# EAGLE design ATMega328Programmer (EAGLE 6.1)
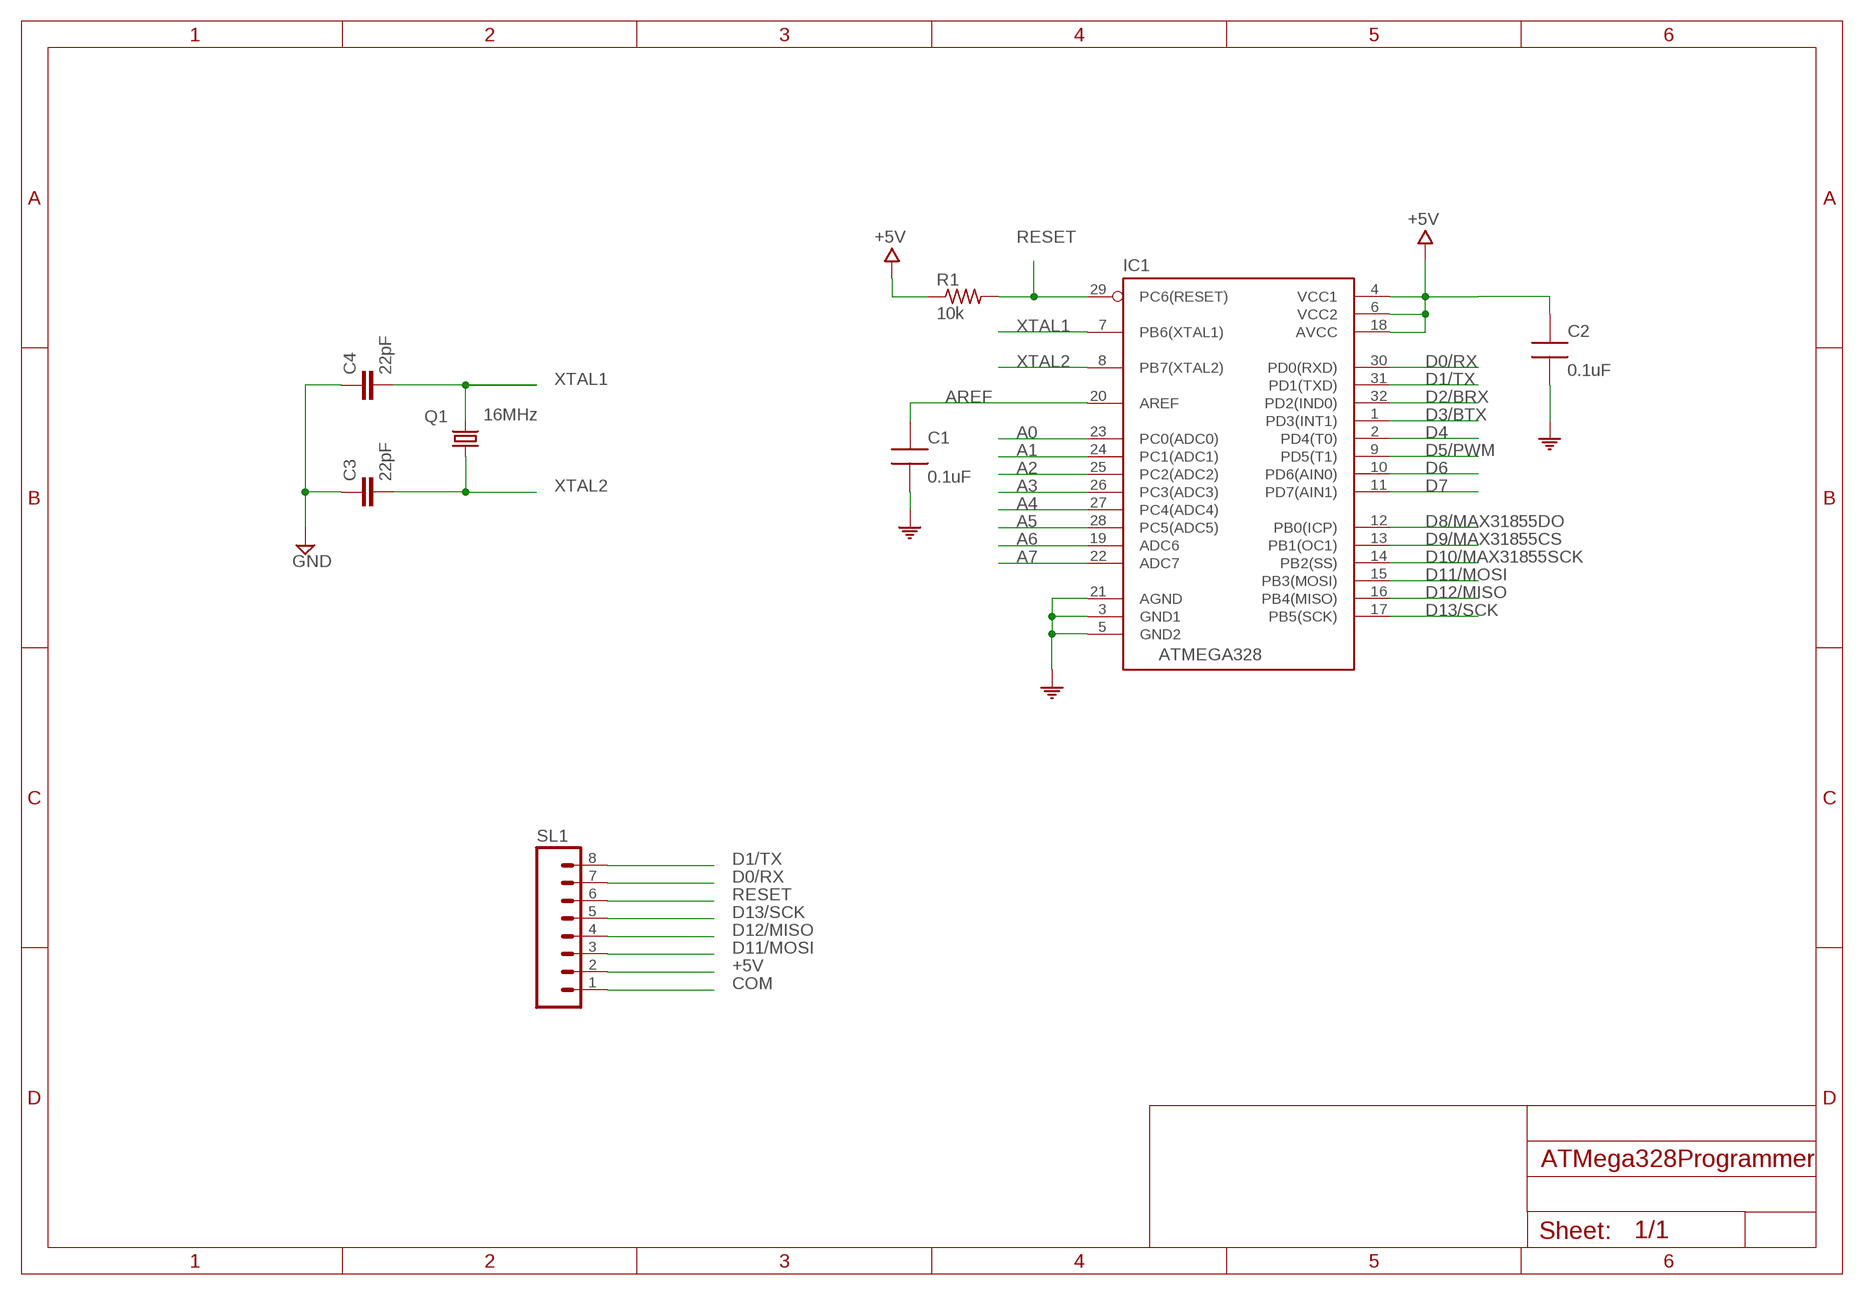
[diagram p0: schematic, sheet 1]

## Parts
C1  0.1uF  CAP0805-NP  [CAP0805-NP]
C2  0.1uF  CAP0805-NP  [CAP0805-NP]
C3  22pF  C-EUC0805  [C0805]
C4  22pF  C-EUC0805  [C0805]
IC1  ATMEGA328  ATMEGA168-20AU  [QFP032]
Q1  16MHz  CRYSTALHC49S  [HC49/S]
R1  10k  R-US_M0805  [M0805]
SL1  M08  [08P]

## Nets
+5V: C2.1 IC1.4(VCC1) IC1.6(VCC2) IC1.18(AVCC) R1.1 SL1.2
A0: IC1.23(PC0(ADC0))
A1: IC1.24(PC1(ADC1))
A2: IC1.25(PC2(ADC2))
A3: IC1.26(PC3(ADC3))
A4: IC1.27(PC4(ADC4))
A5: IC1.28(PC5(ADC5))
A6: IC1.19(ADC6)
A7: IC1.22(ADC7)
AREF: C1.1 IC1.20(AREF)
COM: C1.2 C2.2 C3.1 C4.1 IC1.3(GND1) IC1.5(GND2) IC1.21(AGND) SL1.1 ; supply symbol labelled GND
D0/RX: IC1.30(PD0(RXD)) SL1.7
D1/TX: IC1.31(PD1(TXD)) SL1.8
D2/BRX: IC1.32(PD2(IND0))
D3/BTX: IC1.1(PD3(INT1))
D4: IC1.2(PD4(T0))
D5/PWM: IC1.9(PD5(T1))
D6: IC1.10(PD6(AIN0))
D7: IC1.11(PD7(AIN1))
D8/MAX31855DO: IC1.12(PB0(ICP))
D9/MAX31855CS: IC1.13(PB1(OC1))
D10/MAX31855SCK: IC1.14(PB2(SS))
D11/MOSI: IC1.15(PB3(MOSI)) SL1.3
D12/MISO: IC1.16(PB4(MISO)) SL1.4
D13/SCK: IC1.17(PB5(SCK)) SL1.5
RESET: IC1.29(PC6(RESET)) R1.2 SL1.6
XTAL1: C4.2 IC1.7(PB6(XTAL1)) Q1.2
XTAL2: C3.2 IC1.8(PB7(XTAL2)) Q1.1

## Notes on the sheet
- RESET
- XTAL1
- XTAL2
- XTAL1
- XTAL2
- D1/TX
- D0/RX
- RESET
- D13/SCK
- D12/MISO
- D11/MOSI
- +5V
- COM

## Library data of the parts
C1 C2 = MySMD:CAP0805-NP
C3 C4 = rcl:C-EU: CAPACITOR, European symbol
IC1 = MySMD:ATMEGA168-20AU
Q1 = crystal:CRYSTAL: CRYSTAL
R1 = rcl:R-US_: RESISTOR, American symbol
SL1 = con-amp-quick:M08: AMP QUICK CONNECTOR; OC_FARNELL: unknown; OC_NEWARK: unknown

## Net classes
1 Power: width 1.016 mm, drill 0.61 mm, clearance 0.61 mm

## Board
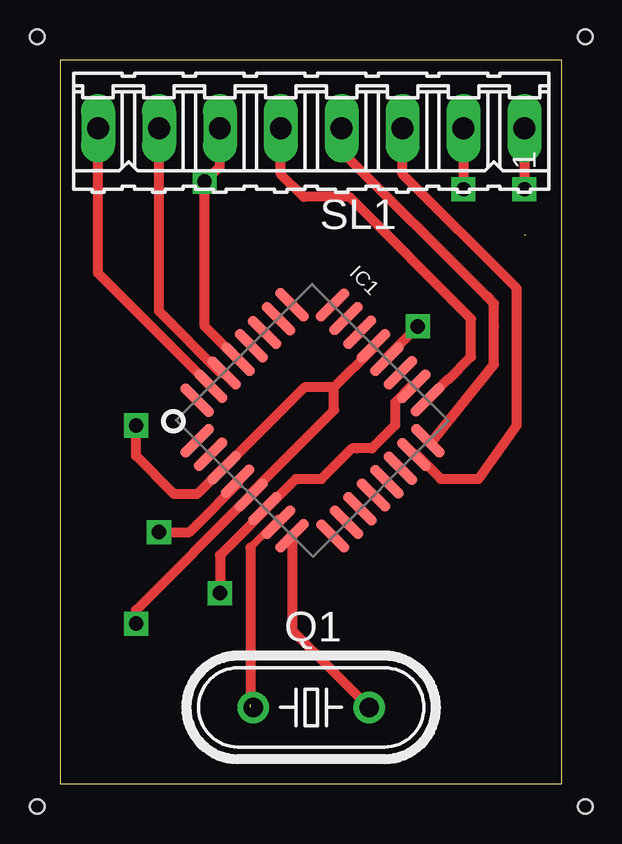
[diagram p1: board, top side]
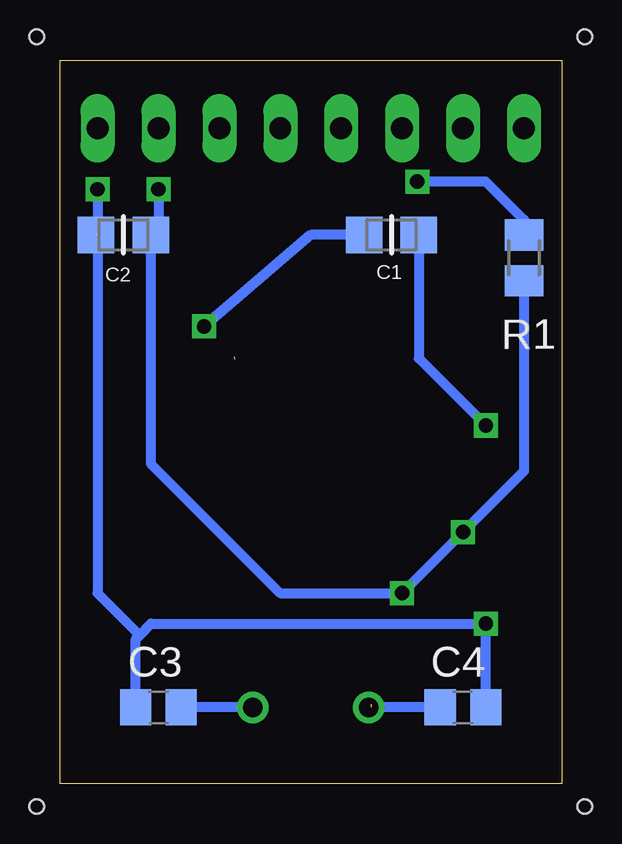
[diagram p2: board, bottom side, seen from below]

Size 20.93 x 30.15 mm. Coordinates in mm from the lower left corner, seen from the top.
Outline: 0,0 20.93,0 20.93,30.15 0,30.15 0,0
Copper layers (1*16): Top 0.035mm / dielectric 1.5mm / Bottom 0.035mm
Design rules: minimum track width 10mil, minimum drill 24mil, track to track 8mil, track to pad 8mil, pad to pad 8mil, via to via 8mil, smd to smd 8mil, copper to edge 40mil, drill to drill 8mil, minimum pad ring 10mil, minimum via ring 8mil, stop-mask expansion 4mil, vias tented up to drill 0mil, thermal gap 10mil
Holes 0.6 mm at -0.95,-0.95 21.91,-0.95 21.91,31.11 -0.95,31.11

### Footprints (pad centres in the part's own frame; a part is rotated, then mirrored left to right if it is on the bottom)
CAP0805-NP = smd 1.524 x 1.524: 1 0,0; 2 2.286,0
C0805 = smd 1.3 x 1.5: 1 -0.95,0; 2 0.95,0
QFP032 = smd 0.432 x 1.778: 1 0,0; 2 0.8,0; 3 1.599,0; 4 2.399,0; 5 3.199,0; 6 3.998,0; 7 4.798,0; 8 5.598,0; 17 5.588,8.001; 18 4.798,7.997; 19 3.998,7.997; 20 3.199,7.997; 21 2.399,7.997; 22 1.599,7.997; 23 0.799,7.997; 24 0,7.997 | smd 1.778 x 0.432: 9 6.807,1.194; 10 6.807,2.007; 11 6.807,2.794; 12 6.807,3.607; 13 6.807,4.394; 14 6.807,5.182; 15 6.807,5.994; 16 6.816,6.803; 25 -1.194,6.807; 26 -1.194,5.994; 27 -1.194,5.182; 28 -1.194,4.394; 29 -1.194,3.607; 30 -1.194,2.794; 31 -1.194,2.007; 32 -1.194,1.194
HC49/S = drill 0.813: 1 -2.413,0; 2 2.413,0
M0805 = smd 1.3 x 1.6: 1 -0.95,0; 2 0.95,0
08P = drill 0.914 long: 1 -8.89,0; 2 -6.35,0; 3 -3.81,0; 4 -1.27,0; 5 1.27,0; 6 3.81,0; 7 6.35,0; 8 8.89,0

### Placement (x,y rotation side)
C1  8.26,22.86 0 bottom
C2  17.14,22.86 180 bottom
C3  16.83,3.17 0 bottom
C4  4.13,3.17 180 bottom
IC1  5.71,14.29 315 top
Q1  10.48,3.17 180 top
R1  1.59,21.91 90 bottom
SL1  10.48,27.3 180 top

### Tracks (layer width: path | path; a pad name or v marks a point on that pad's centre or on a via)
+5V  (via drill 0.6)
  Top 0.406: IC1.18 14.64,16.55 13.97,15.88 13.97,14.92 13.02,13.97 12.38,13.97 12.18,13.97 10.91,12.7 9.84,12.7 8.6,11.46 IC1.6 8.54,11.4 6.67,9.53 6.67,8.26 v6.67,7.94 | SL1.2 v16.83,24.77 | IC1.4 7.41,12.49 5.71,10.79 5.4,10.48 v4.13,10.48
  Bottom 0.406: v16.83,24.77 16.83,23.18 C2.1 17.14,13.34 | R1.1 1.59,13.02 | 17.14,13.34 11.75,7.94 | 17.14,13.34 11.75,7.94 | 11.75,7.94 v6.67,7.94 v4.13,10.48 | 1.59,13.02 v4.13,10.48 | 1.59,13.02 v4.13,10.48
AREF  (via drill 0.6)  (1 unrouted)
  Top 0.406: 13.65,17.78 v14.92,19.05
  Bottom 0.406: C1.1 10.48,22.86 v14.92,19.05
COM  (via drill 0.6)  (1 unrouted)
  Top 0.406: SL1.1 v19.37,24.77 | IC1.21 13.07,18.15 11.43,16.51 | 11.43,16.51 10.2,16.51 IC1.3 6.81,13.16 5.71,12.06 4.76,12.06 3.17,13.65 v3.17,14.92 | 11.43,16.51 11.43,15.56 7.98,12.1 IC1.5 3.17,7.22 v3.17,6.67
  Bottom 0.406: v19.37,24.77 19.37,22.86 19.37,7.94 17.62,6.19 | C4.1 v3.18,6.67 v3.17,6.67 17.14,6.67 17.62,6.19 | C3.1 17.78,6.04 17.62,6.19 | C1.2 5.97,17.72 v3.17,14.92
D0/RX
  Top 0.406: IC1.30 6.71,17.11 4.13,19.68 SL1.7
D1/TX
  Top 0.406: IC1.31 6.29,16.57 1.59,21.27 SL1.8
D11/MOSI
  Top 0.406: IC1.15 14.86,13.71 15.88,12.7 16.51,12.7 17.46,12.7 19.05,14.92 19.05,20.64 14.29,25.4 SL1.3
D12/MISO
  Top 0.406: IC1.16 15.55,14.28 18.1,17.46 18.1,19.05 18.1,20 17.78,20.32 11.75,26.35 SL1.4
D13/SCK
  Top 0.406: IC1.17 16.16,16.83 16.19,16.83 17.14,17.78 17.14,19.37 12.06,24.45 10.16,24.45 9.21,25.4 SL1.5
RESET  (via drill 0.6)
  Top 0.406: IC1.29 7.4,17.68 6.03,19.05 v6.03,25.08 6.67,25.72 SL1.6
  Bottom 0.406: R1.2 1.59,23.5 3.17,25.08 v6.03,25.08
XTAL1  (1 unrouted)
  Top 0.305: 9.11,11.01 7.94,9.84
  Top 0.406: IC1.7 9.11,11.01 | 7.94,9.84 7.94,3.3 Q1.2
  Bottom 0.406: C4.2 7.94,3.17 8.26,3.17
XTAL2
  Top 0.406: IC1.8 9.67,6.39 Q1.1
  Bottom 0.406: Q1.1 C3.2